# EAGLE design rlabTT (EAGLE 6.5.0)

## Sheet 1 of 2
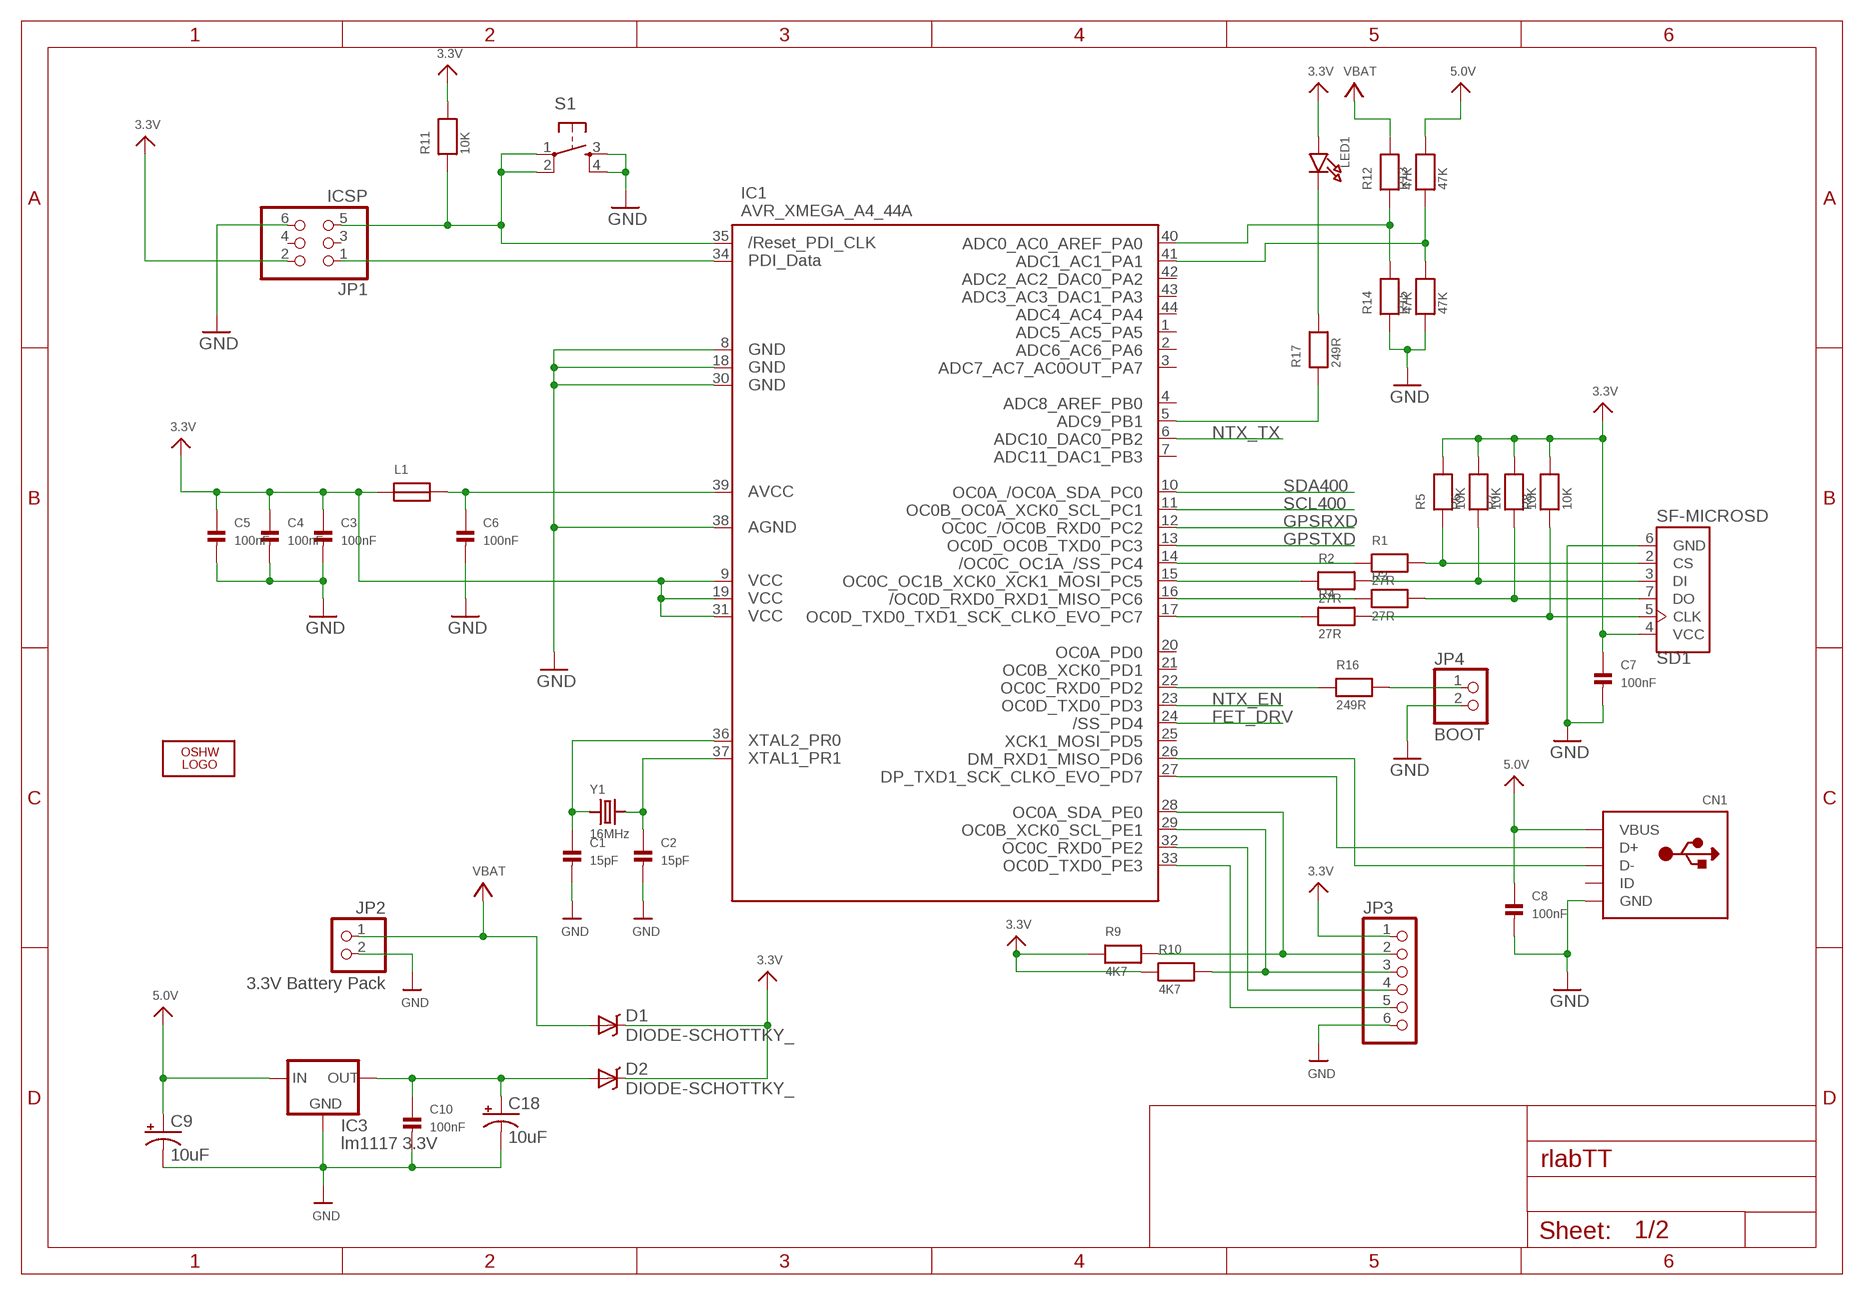
[diagram p0: schematic, sheet 1]

### Parts
C1  15pF  CAP_CERAMIC0603  [0603]
C2  15pF  CAP_CERAMIC0603  [0603]
C3  100nF  CAP_CERAMIC0603  [0603]
C4  100nF  CAP_CERAMIC0603  [0603]
C5  100nF  CAP_CERAMIC0603  [0603]
C6  100nF  CAP_CERAMIC0603  [0603]
C7  100nF  CAP_CERAMIC0603  [0603]
C8  100nF  CAP_CERAMIC0603  [0603]
C9  10uF  CAP_POL3528  [EIA3528]
C10  100nF  CAP_CERAMIC0603  [0603]
C18  10uF  CAP_POL3528  [EIA3528]
CN1  USBMINIB  [USB-MINIB]
D1  DIODE-SCHOTTKY_  [SMA-DIODE]
D2  DIODE-SCHOTTKY_  [SMA-DIODE]
IC1  AVR_XMEGA_A4_44A  [TQFP44]
IC3  lm1117 3.3V  LM1117  [SOT223]
JP1  ICSP  PINHD-2X3/90  [2X03/90]
JP2  3.3V Battery Pack  PINHD-1X2/90  [1X02/90]
JP3  PINHD-1X6/90  [1X06/90]
JP4  BOOT  PINHD-1X2/90  [1X02/90]
L1  FERRITE  [0603]
LED1  LED0603  [CHIPLED_0603]
LOGO1  OSHW_LOGO_8MILX0150-NT  [OSHW_8X150_NOTEXT]
R1  27R  RESISTOR0603  [0603]
R2  27R  RESISTOR0603  [0603]
R3  27R  RESISTOR0603  [0603]
R4  27R  RESISTOR0603  [0603]
R5  10K  RESISTOR0603  [0603]
R6  10K  RESISTOR0603  [0603]
R7  10K  RESISTOR0603  [0603]
R8  10K  RESISTOR0603  [0603]
R9  4K7  RESISTOR0603  [0603]
R10  4K7  RESISTOR0603  [0603]
R11  10K  RESISTOR0603  [0603]
R12  47K  RESISTOR0603  [0603]
R13  47K  RESISTOR0603  [0603]
R14  47K  RESISTOR0603  [0603]
R15  47K  RESISTOR0603  [0603]
R16  249R  RESISTOR0603  [0603]
R17  249R  RESISTOR0603  [0603]
S1  TAC_SWITCHSMD  [TACTILE_SWITCH_SMD]
SD1  SF-MICROSD  [MICROSD]
Y1  16MHz  CRYSTALTHIN  [CRYSTAL_3.2X2.5]

### Nets
3.3V: C3.1 C4.1 C5.1 C7.1 D1.C D2.C IC1.9(VCC1) IC1.19(VCC2) IC1.31(VCC3) JP1.2 JP3.1 L1.1 LED1.A R5.2 R6.2 R7.2 R8.2 R9.1 R10.1 R11.2 SD1.4(VCC) ; also sheet 2
5.0V: C8.1 C9.A(+) CN1.VBUS IC3.3(IN) R13.2
FET_DRV: IC1.24(PD4) ; also sheet 2
GND: C1.2 C2.2 C3.2 C4.2 C5.2 C6.2 C7.2 C8.2 C9.C(-) C10.2 C18.C(-) CN1.GND IC1.8(GND1) IC1.18(GND2) IC1.30(GND3) IC1.38(AGND) IC3.1(GND) JP1.6 JP2.2 JP3.6 JP4.2 R14.1 R15.1 S1.3 S1.4 SD1.6(GND) ; also sheet 2
GPSRXD: IC1.12(PC2) ; also sheet 2
GPSTXD: IC1.13(PC3) ; also sheet 2
N$1: IC1.40(PA0) R12.1 R14.2
N$2: IC1.22(PD2) R16.1
N$3: IC1.41(PA1) R13.1 R15.2
N$4: JP4.1 R16.2
N$5: IC1.5(PB1) R17.1
N$6: LED1.C R17.2
N$9: C2.1 IC1.37(PR1) Y1.2
N$10: C1.1 IC1.36(PR0) Y1.1
N$11: C6.1 IC1.39(AVCC) L1.2
N$13: IC1.14(PC4) R1.1
N$14: CN1.D+ IC1.27(PD7)
N$15: CN1.D- IC1.26(PD6)
N$16: IC1.15(PC5) R2.1
N$17: IC1.16(PC6) R3.1
N$18: IC1.17(PC7) R4.1
N$19: R1.2 R5.1 SD1.2(CS)
N$20: R2.2 R6.1 SD1.3(DI)
N$22: R3.2 R7.1 SD1.7(DO)
N$24: IC1.35(RESET) JP1.5 R11.1 S1.1 S1.2
N$26: IC1.34(PDI_DATA) JP1.1
N$27: C10.1 C18.A(+) D2.A IC3.2(OUT)
N$28: IC1.28(PE0) JP3.2 R9.2
N$29: IC1.29(PE1) JP3.3 R10.2
N$30: IC1.32(PE2) JP3.4
N$31: IC1.33(PE3) JP3.5
NTX_EN: IC1.23(PD3) ; also sheet 2
NTX_TX: IC1.6(PB2) ; also sheet 2
SCL400: IC1.11(PC1) ; also sheet 2
SD1: R4.2 R8.1 SD1.5(CLK)
SDA400: IC1.10(PC0) ; also sheet 2
VBAT: D1.A JP2.1 R12.2
Unconnected: CN1.ID IC1.1(PA5) IC1.2(PA6) IC1.3(PA7) IC1.4(PB0) IC1.7(PB3) IC1.20(PD0) IC1.21(PD1) IC1.25(PD5) IC1.42(PA2) IC1.43(PA3) IC1.44(PA4) JP1.3 JP1.4

## Sheet 2 of 2
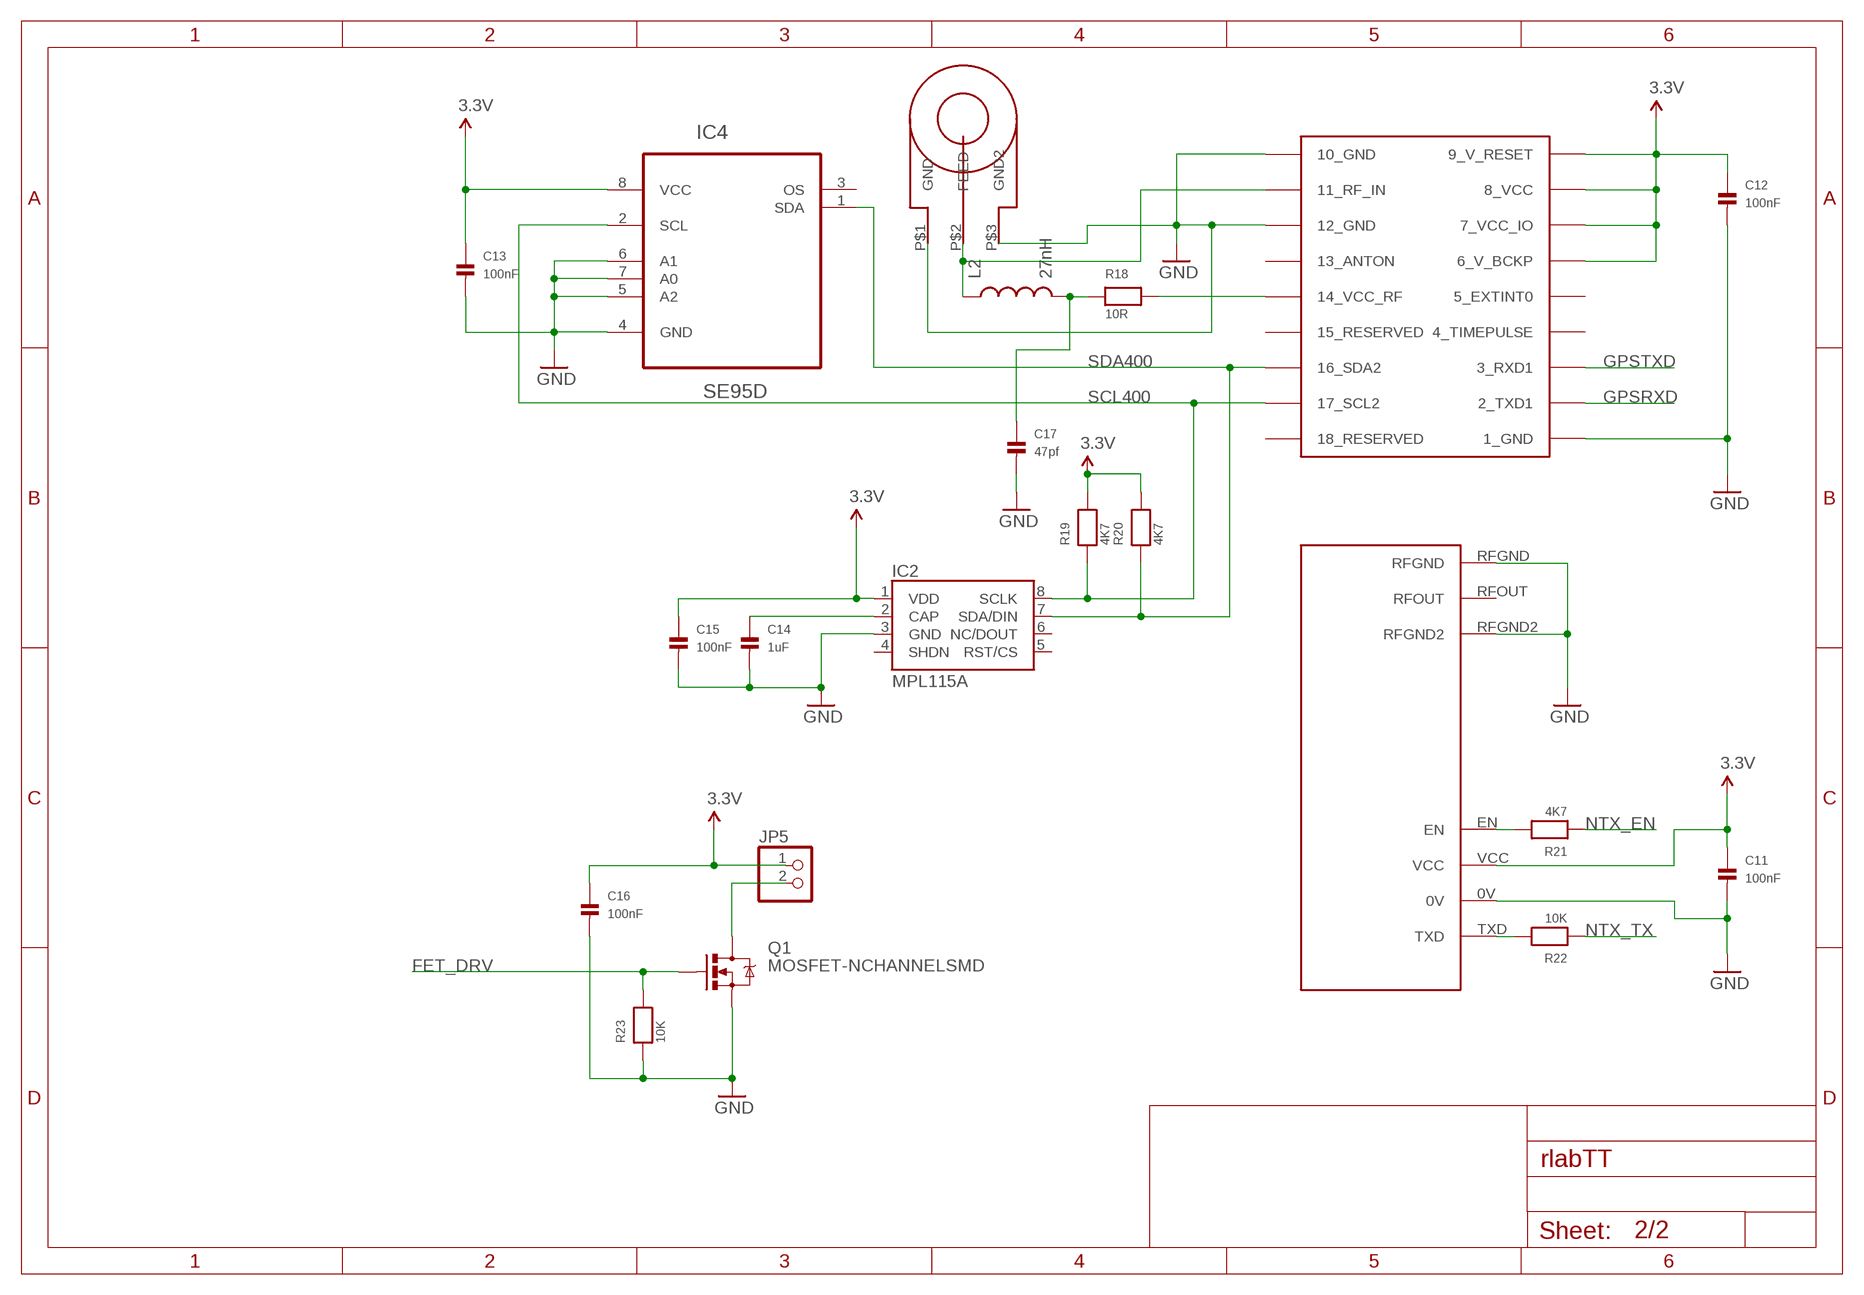
[diagram p1: schematic, sheet 2]

### Parts
C11  100nF  CAP_CERAMIC0603  [0603]
C12  100nF  CAP_CERAMIC0603  [0603]
C13  100nF  CAP_CERAMIC0603  [0603]
C14  1uF  CAP_CERAMIC0603  [0603]
C15  100nF  CAP_CERAMIC0603  [0603]
C16  100nF  CAP_CERAMIC0603  [0603]
C17  47pf  CAP_CERAMIC0603  [0603]
IC2  MPL115A  [LGA8]
IC4  SE95D  [SOIC127P600X175-8N]
JP5  PINHD-1X2/90  [1X02/90]
L2  27nH  INDUCTOR0603  [0603]
Q1  MOSFET-NCHANNELSMD  [SOT23-3]
R18  10R  RESISTOR0603  [0603]
R19  4K7  RESISTOR0603  [0603]
R20  4K7  RESISTOR0603  [0603]
R21  4K7  RESISTOR0603  [0603]
R22  10K  RESISTOR0603  [0603]
R23  10K  RESISTOR0603  [0603]
U1  UBLOX_MAX  [UBLOX_MAX]
U2  NTX2  [NTX2]
U3  SARANTEL-SL1250  [SARANTEL-SL1250]

### Nets
3.3V: C11.1 C12.1 C13.1 C15.1 C16.1 IC2.1(VDD) IC4.8(VCC) JP5.1 R19.2 R20.2 U1.6_V_BCKP U1.7_VCC_IO U1.8_VCC U1.9_V_RESET U2.VCC ; also sheet 1
FET_DRV: Q1.1(G) R23.2 ; also sheet 1
GND: C11.2 C12.2 C13.2 C14.2 C15.2 C16.2 C17.2 IC2.3(GND) IC4.4(GND) IC4.5(A2) IC4.6(A1) IC4.7(A0) Q1.2(S) R23.1 U1.1_GND U1.10_GND U1.12_GND U2.0V U2.RFGND U2.RFGND2 U3.P$1(GND) U3.P$3(GND2) ; also sheet 1
GPSRXD: U1.2_TXD1 ; also sheet 1
GPSTXD: U1.3_RXD1 ; also sheet 1
N$7: L2.1 U1.11_RF_IN U3.P$2(FEED)
N$8: R21.2 U2.EN
N$25: R18.2 U1.14_VCC_RF
N$32: C17.1 L2.2 R18.1
N$35: R22.2 U2.TXD
N$36: JP5.2 Q1.3(D)
N$37: C14.1 IC2.2(CAP)
NTX_EN: R21.1 ; also sheet 1
NTX_TX: R22.1 ; also sheet 1
SCL400: IC2.8(SCLK) IC4.2(SCL) R19.1 U1.17_SCL2 ; also sheet 1
SDA400: IC2.7(SDA/DIN) IC4.1(SDA) R20.1 U1.16_SDA2 ; also sheet 1
Unconnected: IC2.4(SHDN) IC2.5(RST/CS) IC2.6(NC/DOUT) IC4.3(OS) U1.4_TIMEPULSE U1.5_EXTINT0 U1.13_ANTON U1.15_RESERVED U1.18_RESERVED U2.RFOUT

## Library data of the parts
C1-C8 C10-C17 = microbuilder:CAP_CERAMIC: Ceramic Capacitors 0402 - 0402 Surface Mount Capacitors 0.1uF 10V 10% [Digikey: 490-1318-2-ND] 0603 - 0603 Surface Mount Capacitors 16 pF 50V 5% [Digikey: 445-5051-2-ND] 22 pF 50V [Digikey: PCC220ACVTR-ND] 33 pF 50V 5% [Digikey: 490-1415-1-ND] 56pF 50V 5% [Digikey: 490-1421-1-ND] 220pF 50V 5% [Digikey: 445-1285-1-ND] 680 pF 50V 2200 pF 50V 5% C0G [Digikey: 445-1297-1-ND] 5600 pF 100V 5% X7R [Digikey: 478-3711-1-ND] 0.1 µF 25V 10% [Digikey: PCC2277TR-ND] 0.22 µF 16V 10% X7R [Digikey: 445-1318-1-ND] 1.0 µF 25V 10% [Digikey: 445-5146-2-ND] 0603 - RF Specific 3pF 250V +/-0.1pF RF [Digikey: 712-1347-1-ND] 18 pF 250V 5% [Digikey: 478-3505-1-ND or 712-1322-1-ND] 56 pF 250V 5% C0G RF [Digikey: 490-4867-1-ND] 68 pF 250V RF [Digikey: 490-4868-1-ND] 0805 - 0805 Surface Mount Capacitors 220 pF 250V 2% RF Ceramic Capacitor [Digikey: 712-1398-1-ND] 1000 pF 50V 2% NP0 Ceramic Capacitor [Digikey: 478-3760-1-ND] 0.1 µF 25V 10% Ceramic Capacitor [Digikey: PCC1828TR-ND] 1.0 µF 16V 10% Ceramic Capacitor[Digikey: 490-1691-2-ND] 10.0 µF 10V 10% Ceramic Capacitor[Digikey: 709-1228-1-ND] 1206 - 1206 Surface Mount Capacitors
C9 C18 = SparkFun:CAP_POL: Capacitor Polarized These are standard SMD and PTH capacitors. Normally 10uF, 47uF, and 100uF in electrolytic and tantalum varieties. Always verify the external diameter of the through hole cap, it varies with capacity, voltage, and manufacturer. The EIA devices should be standard.
CN1 = adafruit:USB: USB Connectors USBMINIB - Surface Mount Female Mini-B USB Connector 4UConnector: 06564 By microbuilder.eu Thru-hole RA Female Mini-B USB Connector 4UConnector: 18732 By ladyada.net
D1 D2 = SparkFun:DIODE-SCHOTTKY
IC1 = xmega:AVR_XMEGA_A4_: Device for Atmel AVR XMEGA A4 Series
IC2 = SparkFun:MPL115A: MPL115A1 (SPI) and MPL115A2 (I2C) Miniature Digital Barometer 5.0x3.0x1.2mm LGA Package
IC3 = v-reg-3:LM1117
IC4 = NXP_By_element14_Batch_1:SE95D
JP1 = pinhead:PINHD-2X3: PIN HEADER
JP2 JP4 JP5 = pinhead:PINHD-1X2: PIN HEADER
JP3 = pinhead:PINHD-1X6: PIN HEADER
L1 = microbuilder:FERRITE: Ferrite Bead 0603 120 Ohm, 600mA Ferrite Chip - Digikey: 445-2164-1-ND
L2 = SparkFun:INDUCTOR: Inductors Basic Inductor/Choke - 0603 and 1206. Footprints are not proven and vary greatly between part numbers.
LED1 = microbuilder:LED: LED 0603 - 0603 Surface Mount Package Green LED - Low Power (3.9mcd, 2ma, 1.7Vf) Orange LED - Low Power (9.8mcd, 2ma, 1.8Vf) Red LED - Low Power (5mcd, 2ma, 1.8Vf) Yellow LED - Low Power (7mcd, 2ma, 1.8Vf) 0805 - 0805 Surface Mount Package 20mA: Red LED (104mcd, 20mA, Diffused) - LS R976 [Digikey: 475-1278-6-ND] Red LED (12mcd, 20mA, 2.0Vf, Clear) - APT2012EC [Digikey: 754-1128-1-ND] Green LED (15mcd, 20mA, 2.2Vf, Clear) - APT2012GC [Digikey: 754-1131-1-ND] Orange LED (160mcd, 20mA, 2.1Vf, Clear) - APT2012SECK [Digikey: 754-1130-1-ND] 2mA: Red LED (8.8mcd, 2mA, 1.8Vf, Clear) - Low Power [Digikey: 475-2510-1-ND] Green LED (5mcd, 2mA, 1.8Vf, Clear) - Low Power [Digikey: 475-2730-1-ND] Yellow LED (11.3mcd, 2mA, 1.8Vf, Clear) - Low Power [Digikey: 475-2555-1-ND] 1206 - 1206 Surface Mount Package Green LED (26mcd, 20mA, Diffused) - LG N971 [Digikey: 475-1407-6-ND] Red LED (15mcd, 20mA, Diffused) - LH N974 [Digikey: 475-1416-6-ND]
LOGO1 = ohw-logo:OSHW_LOGO_8MIL
Q1 = SparkFun:MOSFET-NCHANNEL
R1-R23 = microbuilder:RESISTOR: Resistors 0402 - 0402 Surface Mount Package 10.0K 1% 1/16W [Digikey: 311-10.0KLRTR-ND] 0603 - 0603 Surface Mount Package 0 Ohm 1/10 Watt 1% Resistor 15 Ohm 1/10 Watt 1% Resistor 33 Ohm 1/10 Watt 1% Resistor 49.9 Ohm 1/10 Watt 1% Resistor 100 Ohm 1/10 Watt 1% Resistor 150 Ohm 1/10 Watt 1% Resistor 240 Ohm 1/10 Watt 1% Resistor 390 Ohm 1/10 Watt 1% Resistor 560 Ohm 1/10 Watt 1% Resistor 750 Ohm 1/10 Watt 1% Resistor 1.0K Ohm 1/10 Watt 1% Resistor 1.5K Ohm 1/10 Watt 1% Resistor 2.0K Ohm 1/10 Watt 1% Resistor 4.7K Ohm 1/10 Watt 1% Resistor 10.0K Ohm 1/10 Watt 1% Resistor 20.0K Ohm 1/10 Watt 1% Resistor 33.0K Ohm 1/10 Watt 1% Resistor 100.0K Ohm 1/10 Watt 1% Resistor 0805 - 0805 Surface Mount Package 0 Ohm 1/8 Watt 1% Resistor 33 Ohm 1/8 Watt 1% Resistor 100 Ohm 1/8 Watt 1% Resistor 150 Ohm 1/8 Watt 1% Resistor 200 Ohm 1/8 Watt 1% Resistor 240 Ohm 1/8 Watt 1% Resistor 330 Ohm 1/8 Watt 1% Resistor 390 Ohm 1/8 Watt 1% Resistor 470 Ohm 1/8 Watt 1% Resistor 1.0K Ohm 1/8 Watt 1% Resistor 1.5K Ohm 1/8 Watt 1% Resistor 2.0K Ohm 1/8 Watt 1% Resistor 4.7K Ohm 1/8 Watt 1% Resistor 5.1K Ohm 1/8 Watt 1% Resistor 5.6K Ohm 1/8 Watt 1% Resistor 10.0K Ohm 1/8 Watt 1% Resistor 22.0K Ohm 1/8 Watt 1% Resistor 33.0K Ohm 1/8 Watt 1% Resistor 100K Ohm 1/8 Watt 1% Resistor 1206 - 1206 Surface Mount Package
S1 = SparkFun:TAC_SWITCH: Momentary Switch Button commonly used for reset or general input. Spark Fun Electronics SKU : COM-00097
SD1 = microsd:SF-MICROSD
U1 = Ava:UBLOX_MAX: UBLOX MAX
U2 = Ava:NTX2: Radiometrix NTX2 Transmitter Module Author Anthony Stirk / http://ava.upuaut.net
U3 = Ava:SARANTEL-SL1250: Sarantel SL1250
Y1 = microbuilder:CRYSTAL: Crystals HC49UP - Surface Mount Crystal 4.0MHz 18pF +/-30ppm Surface Mount Crystal [Digikey: 535-9857-1-ND] 12.0 MHz Surface Mount Crystal [Digikey: 535-9869-6-ND] 25.0 MHz Surface Mount Crystal [Digikey: 535-9078-1-ND] 3.2 x 2.5mm - MEMs SMT Crystal 12.0 MHz 8pF 15ppm 3.2 x 2.5mm Crystal [Digikey: 644-1047-1-ND] 16.0 MHz 8pF 15ppm 3.2 x 2.5mm Crystal [Digikey: 644-1049-1-ND] 16.0 MHz 10pF 10ppm 3.2 x 2.5mm Crystal [Digikey: 644-1100-1-ND] 27.12 MHz 18pF 30ppm 3.2 x 2.5mm Crystal [Digikey: 887-1424-1-ND] 4.9 x 1.8mm - MEMs SMT Crystal 32.768 KHz 12.5pF 20ppm 4.9 x 1.8mm Crystal [Digikey: SE2415CT-ND] Cylinder 32.768KHz Cylinder Crystal

## Board
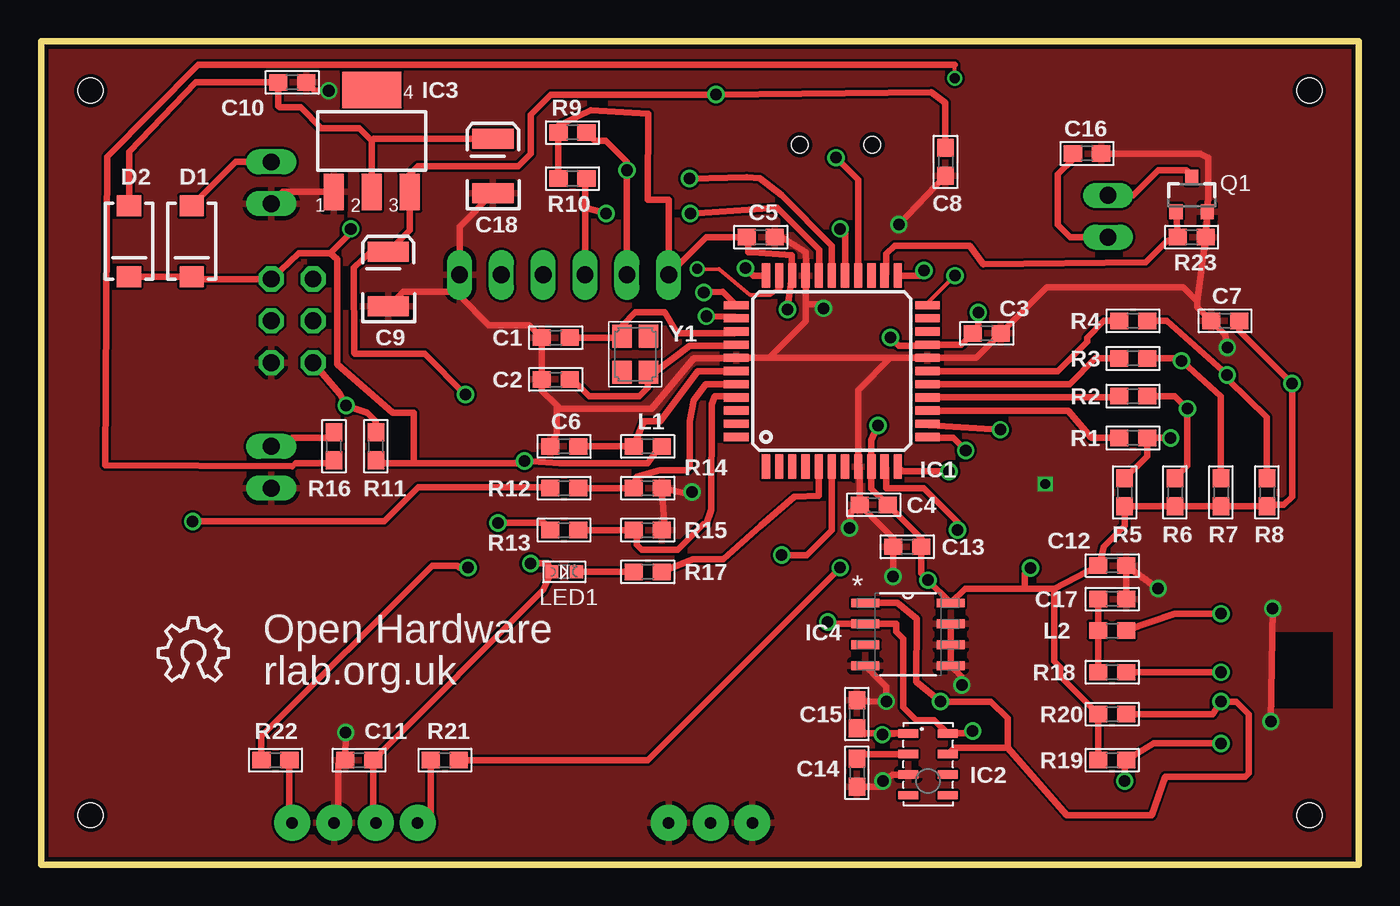
[diagram p2: board, top side]
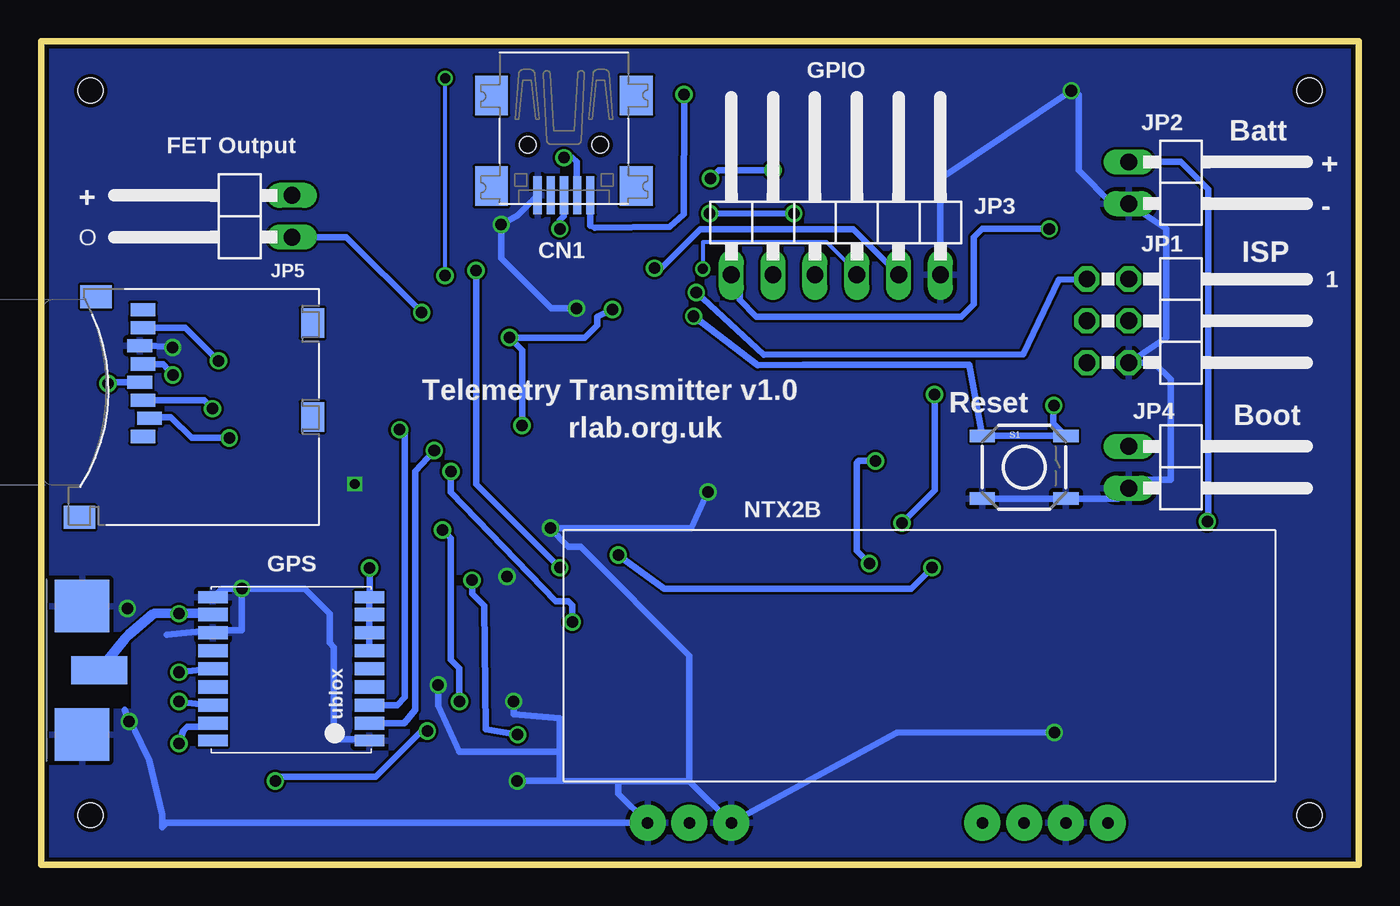
[diagram p3: board, bottom side, seen from below]

Size 80 x 50 mm. Coordinates in mm from the lower left corner, seen from the top.
Outline: 0,0 0,50 80,50 80,0 0,0
Copper layers (1*16): Top 0.035mm / dielectric 1.5mm / Bottom 0.035mm
Design rules "SeeedStudio_2layer_DRU_no_angle_20140221": minimum track width 6mil, minimum drill 12mil, track to track 6mil, track to pad 6mil, pad to pad 6mil, via to via 6mil, smd to smd 0mil, copper to edge 10mil, drill to drill 10mil, minimum pad ring 10mil, minimum via ring 6mil, stop-mask expansion 2mil, vias tented up to drill 100mil, thermal gap 10mil
Holes 1.5 mm at 3,47 77,47 77,3 3,3

### Footprints (pad centres in the part's own frame; a part is rotated, then mirrored left to right if it is on the bottom)
0603 = smd 1.1 x 1: 1 -0.85,0; 2 0.85,0
EIA3528 = smd 1.2 x 2.5: A 1.65,0; C -1.65,0
USB-MINIB = smd 0.5 x 2.308: D+ 0,4.064; D- -0.8,4.064; GND 1.6,4.064; ID 0.8,4.064; VBUS -1.6,4.064 | smd 2 x 2.4: GND1 -4.4,-2; GND2 -4.4,3.5; GND3 4.4,3.5; GND4 4.4,-2 | hole 1: -2.2,1; 2.2,1
SMA-DIODE = smd 1.27 x 1.47: A -2.15,0; C 2.15,0
TQFP44 = smd 1.5 x 0.5: 1 -5.8,4; 2 -5.8,3.2; 3 -5.8,2.4; 4 -5.8,1.6; 5 -5.8,0.8; 6 -5.8,0; 7 -5.8,-0.8; 8 -5.8,-1.6; 9 -5.8,-2.4; 10 -5.8,-3.2; 11 -5.8,-4; 23 5.8,-4; 24 5.8,-3.2; 25 5.8,-2.4; 26 5.8,-1.6; 27 5.8,-0.8; 28 5.8,0; 29 5.8,0.8; 30 5.8,1.6; 31 5.8,2.4; 32 5.8,3.2; 33 5.8,4 | smd 0.5 x 1.5: 12 -4,-5.8; 13 -3.2,-5.8; 14 -2.4,-5.8; 15 -1.6,-5.8; 16 -0.8,-5.8; 17 0,-5.8; 18 0.8,-5.8; 19 1.6,-5.8; 20 2.4,-5.8; 21 3.2,-5.8; 22 4,-5.8; 34 4,5.8; 35 3.2,5.8; 36 2.4,5.8; 37 1.6,5.8; 38 0.8,5.8; 39 0,5.8; 40 -0.8,5.8; 41 -1.6,5.8; 42 -2.4,5.8; 43 -3.2,5.8; 44 -4,5.8
LGA8 = smd 1.2 x 0.5: 1 -1.2,1.875; 2 -1.2,0.625; 3 -1.2,-0.625; 4 -1.2,-1.875; 5 1.2,-1.875; 6 1.2,-0.625; 7 1.2,0.625; 8 1.2,1.875
SOT223 = smd 1.219 x 2.235: 1 -2.311,-3.099; 2 0,-3.099; 3 2.311,-3.099 | smd 3.6 x 2.2: 4 0,3.099
SOIC127P600X175-8N = smd 1.702 x 0.533: 1 -2.591,1.905; 2 -2.591,0.635; 3 -2.591,-0.635; 4 -2.591,-1.905; 5 2.591,-1.905; 6 2.591,-0.635; 7 2.591,0.635; 8 2.591,1.905
2X03/90 = drill 1.016 octagon: 1 -2.54,-6.35; 2 -2.54,-3.81; 3 0,-6.35; 4 0,-3.81; 5 2.54,-6.35; 6 2.54,-3.81
1X02/90 = drill 1.016 long: 1 -1.27,-3.81; 2 1.27,-3.81
1X06/90 = drill 1.016 long: 1 -6.35,-3.81; 2 -3.81,-3.81; 3 -1.27,-3.81; 4 1.27,-3.81; 5 3.81,-3.81; 6 6.35,-3.81
CHIPLED_0603 = smd 0.8 x 0.8: A 0,-0.75; C 0,0.75
SOT23-3 = smd 0.8 x 0.9: 1 -0.95,-1; 2 0.95,-1; 3 0,1.1
TACTILE_SWITCH_SMD = smd 1.524 x 0.762: 1 -2.54,1.905; 2 2.54,1.905; 3 -2.54,-1.905; 4 2.54,-1.905
MICROSD = smd 0.8 x 1.5: 1 -1.94,2.7; 2 -0.84,2.3; 3 0.26,2.7; 4 1.36,2.9; 5 2.46,2.7; 6 3.56,2.9; 7 4.66,2.7; 8 5.76,2.7 | smd 1.4 x 1.9: NC -6.85,6.55; NC3 6.55,5.55 | smd 1.8 x 1.4: NC1 -0.75,-7.6; NC2 4.95,-7.6
UBLOX_MAX = smd 1.8 x 0.7: 1_GND 4.95,-4.4; 9_V_RESET 4.95,4.3; 10_GND -4.55,4.3; 18_RESERVED -4.55,-4.4 | smd 1.8 x 0.8: 2_TXD1 4.95,-3.35; 3_RXD1 4.95,-2.25; 4_TIMEPULSE 4.95,-1.15; 5_EXTINT0 4.95,-0.05; 6_V_BCKP 4.95,1.05; 7_VCC_IO 4.95,2.15; 8_VCC 4.95,3.25; 11_RF_IN -4.55,3.25; 12_GND -4.55,2.15; 13_ANTON -4.55,1.05; 14_VCC_RF -4.55,-0.05; 15_RESERVED -4.55,-1.15; 16_SDA2 -4.55,-2.25; 17_SCL2 -4.55,-3.35
NTX2 = drill 0.7 pad 2.184: 0V -2.54,-10.16; EN -7.62,-10.16; RFGND -22.86,-10.16; RFGND2 -27.94,-10.16; RFOUT -25.4,-10.16; TXD 0,-10.16; VCC -5.08,-10.16
SARANTEL-SL1250 = smd 3.2 x 3.3: P$1 -3.9,-2.15; P$3 3.9,-2.15 | smd 1.7 x 3.4: P$2 0,-3.2
CRYSTAL_3.2X2.5 = smd 1.4 x 1.2: 1 -1.1,-0.8; 2 1.1,0.8; GND1 -1.1,0.8; GND2 1.1,-0.8

### Placement (x,y rotation side)
C1  31.24,32 180 top
C2  31.24,29.46 180 top
C3  57.4,32.26 0 top
C4  50.55,21.84 180 top
C5  43.69,38.1 0 top
C6  31.75,25.4 180 top
C7  71.88,33.02 180 top
C8  54.9,42.67 270 top
C9  21.08,35.56 90 top
C10  15.24,47.5 0 top
C11  19.3,6.35 180 top
C12  65.02,18.16 0 top
C13  52.58,19.3 180 top
C14  49.53,5.59 270 top
C15  49.53,9.14 90 top
C16  63.5,43.18 0 top
C17  65.02,16.13 0 top
C18  27.43,42.42 90 top
CN1  48.26,44.7 180 bottom
D1  9.14,37.85 270 top
D2  5.33,37.85 270 top
IC1  48.01,29.97 90 top
IC2  53.85,6.1 0 top
IC3  20.07,43.94 0 top
IC4  52.63,13.99 0 top
JP1  10.16,33.02 270 bottom
JP2  10.16,41.4 270 bottom
JP3  31.75,39.62 0 bottom
JP4  10.16,24.13 270 bottom
JP5  68.58,39.37 90 bottom
L1  36.83,25.4 180 top
L2  65.02,14.22 180 top
LED1  31.75,17.78 270 top
LOGO1  7.11,11.18 0 top
Q1  69.85,40.64 0 top
R1  66.29,25.91 0 top
R2  66.29,28.45 0 top
R3  66.29,30.73 0 top
R4  66.29,33.02 0 top
R5  65.79,22.61 270 top
R6  68.83,22.61 270 top
R7  71.63,22.61 270 top
R8  74.42,22.61 270 top
R9  32.26,44.45 0 top
R10  32.26,41.66 0 top
R11  20.32,25.4 270 top
R12  31.75,22.86 180 top
R13  31.75,20.32 180 top
R14  36.83,22.86 180 top
R15  36.83,20.32 180 top
R16  17.78,25.4 90 top
R17  36.83,17.78 180 top
R18  65.02,11.68 0 top
R19  65.02,6.35 180 top
R20  65.02,9.14 180 top
R21  24.51,6.35 180 top
R22  14.22,6.35 0 top
R23  69.85,38.1 180 top
S1  20.32,24.13 0 bottom
SD1  71.12,27.94 90 bottom
U1  65.02,11.94 0 bottom
U2  15.24,12.7 0 bottom
U3  79.67,11.8 90 bottom
Y1  36.07,30.99 270 top

### Tracks (layer width: path | path; a pad name or v marks a point on that pad's centre or on a via)
3.3V  (via drill 0.7)
  Top 0.406: C7.1 72.73,32.42 v75.95,29.21 75.95,22.35 75.44,21.84 74.51,21.84 R8.2 R7.2 R6.2 R5.2 65.79,20.57 64.52,19.3 64.26,18.25 C12.1 61.51,16.76 | C16.1 62.65,42.84 61.72,41.91 61.72,38.86 62.48,38.1 JP5.1 | C15.1 49.85,7.97 IC2.1 52.64,8 v51.07,7.89 | U2.VCC 20.15,2.71 C11.1 30.49,16.69 LED1.A 30.75,18.29 v29.72,18.29 | v56.9,33.53 56.9,32.6 C3.1 55.87,31.57 IC1.19 53.73,31.5 52.07,31.5 v51.56,32 | R10.1 R9.1 31.41,44.87 33.36,45.81 36.85,45.6 36.83,40.64 36.83,40.39 38.1,40.39 JP3.1 40.39,38.1 C5.1 42.93,37.85 42.93,37.19 43.19,37.19 45.57,36.99 45.57,35.92 IC1.31 45.57,35.64 v45.31,33.71 | R11.2 20.49,24.38 22.61,24.38 | 22.61,24.38 29.21,24.38 v29.34,24.51 31.5,24.38 36.83,24.38 37.45,25.29 L1.1 | R19.2 R20.2 61.88,11.44 61.88,11.99 61.51,12.36 61.51,16.76 | v50.8,26.67 50.41,25.77 IC1.9 50.41,22.83 C4.1 53.43,19.81 C13.1 53.43,17.68 v53.84,17.27 IC4.8 56.09,16.76 59.71,16.76 | D2.C D1.C 9.28,35.56 JP1.2 15.63,37.12 17.56,37.12 | 17.56,37.12 17.98,36.76 17.96,30.39 21.34,27.43 22.61,27.43 22.61,24.38 | 17.56,37.12 18.8,38.35 v18.8,38.61 | 59.71,16.76 61.51,16.76 | v60.06,18.02 59.71,17.67 59.71,16.76
  Bottom 0.406: SD1.4 75.86,29.3 v75.95,29.21 | v56.9,33.53 61.47,38.1 JP5.1 | v50.8,26.67 50.8,31.24 v51.56,32 46.99,32 46.23,32.77 46.23,33.27 v45.31,33.71 | v29.72,18.29 30.48,19.05 30.48,24.38 30.35,24.51 v29.34,24.51 | JP3.1 37.59,35.31 37.59,34.29 36.58,33.27 24.13,33.27 23.37,34.04 23.37,38.1 22.86,38.61 v18.8,38.61 | v60.06,18.02 U1.9_V_RESET U1.8_VCC U1.7_VCC_IO U1.6_V_BCKP | v51.07,7.89 52.99,8.22 53.11,15.73 53.84,16.45 v53.84,17.27
5.0V  (via drill 0.7)
  Top 0.406: C8.1 54.88,46.26 54.05,46.91 v40.96,46.76 30.93,46.76 29.72,45.54 29.72,43.18 28.96,42.42 22.86,42.42 22.38,41.94 IC3.3 22.38,38.51 C9.A 20,37.21 18.97,36.24 19.01,31.08 19.05,31.02 23.28,31.02 v25.76,28.54 | R13.2 30.53,20.75 v27.73,20.75
  Bottom 0.406: v40.96,46.76 40.95,46.62 40.99,39.48 41.82,38.74 46.38,38.69 46.66,38.78 CN1.VBUS | v27.73,20.75 25.76,22.72 v25.76,28.54
FET_DRV
  Top 0.406: IC1.24 51.31,35.87 51.31,37.08 51.82,37.59 56.39,37.59 57.19,36.45 67.06,36.58 68.33,37.85 R23.2 Q1.1
GND  (via drill 0.6, 0.7)
  Top 0.406: v72.02,31.4 71.88,32.17 C7.2 70.19,33.86 70.19,34.2 | 70.19,34.2 R23.1 Q1.2 70.87,40.47 70.87,42.93 70.36,43.18 C16.2 | 51.56,30.77 IC1.18 56.77,30.77 C3.2 61.05,35.05 69.34,35.05 70.19,34.2 | 51.56,30.77 44.2,30.77 | 44.2,30.77 IC1.38 42.17,30.73 39.62,30.73 37.08,27.69 31.5,27.69 31.3,27.88 | 46.41,34.04 IC1.30 46.48,35.85 46.43,37.18 44.96,38.1 C5.2 | 46.41,34.04 46.41,32.98 44.2,30.77 | 51.56,30.77 49.61,28.82 IC1.8 49.7,24.08 C4.2 | 51.82,19.22 C13.2 | C13.2 51.73,19.81 C4.2 | IC2.3 51.7,5.47 v51.1,5.09 50.97,4.74 C14.2 | C15.2 49.62,9.91 v51.31,9.92 51.31,10.81 IC4.4 | v67.82,16.76 C12.2 C17.2 | U2.0V 18.03,2.79 18.03,6.1 18.29,6.35 C11.2 v18.49,8.03 | 31.3,27.88 30.39,28.79 C2.2 C1.2 29.63,32.77 27.18,32.77 25.4,34.54 JP3.6 | v52.07,38.86 C8.2 | v47.5,33.78 47.24,34.04 46.41,34.04 | C9.C 21.97,34.8 25.15,34.8 25.4,35.05 JP3.6 | JP2.2 14.68,40.84 IC3.1 | C10.2 16.6,46.99 v17.46,46.99 | C4.2 49.14,21.42 v49.09,20.44 | v74.77,15.56 v74.66,8.69 | IC4.7 IC4.6 IC4.5 55.87,11.43 v55.9,10.92 | v51.71,17.49 51.73,17.51 C13.2 | C6.2 31.3,26.17 31.3,27.88 | R15.1 37.85,20.39 R14.1 38.98,22.59 v39.52,22.63 | C18.C 25.4,38.74 JP3.6
  Bottom 0.406: SD1.6 71.91,31.46 v72.02,31.4 | v51.31,9.92 51.31,9.14 48.51,8.89 48.51,5.08 | U1.10_GND 69.05,16.76 v67.82,16.76 | v67.82,16.76 67.82,14.22 69.44,14.22 U1.12_GND 69.71,14.22 72.39,13.97 | 40.64,5.08 44.96,5.08 | 44.96,5.08 48.51,5.08 | 48.51,5.08 v51.1,5.09 | 44.96,5.08 44.96,4.32 U2.RFGND2 72.39,2.54 72.64,2.29 72.64,3.05 73.43,6.33 74.93,9.4 v74.66,8.69 | v47.5,33.78 49.02,33.78 52.07,36.83 v52.07,38.86 51.05,39.45 CN1.GND | S1.3 S1.4 14.61,22.23 JP4.2 13.46,23.37 11.43,23.37 11.43,29.46 12.45,30.48 JP1.6 11.68,32 11.68,38.61 JP2.2 14.99,40.13 17.02,42.16 17.02,46.74 v17.46,46.99 25.4,41.66 JP3.6 | U1.1_GND 60.16,7.62 62.23,7.62 62.23,13.21 62.48,13.46 62.48,15.24 64.01,16.76 v67.82,16.76 | 40.64,5.08 40.64,12.7 47.24,19.3 48.01,19.3 v49.09,20.44 40.53,20.44 v39.52,22.63 | 40.64,5.08 U2.RFGND 28.07,8 v18.49,8.03 | 48.51,5.08 48.51,6.86 54.61,6.86 55.88,9.65 v55.9,10.92
  other vias: 60.96,23.11
  pour Top: 0,0 0,50 80,50 80,0
  pour Bottom: 0,0 0,50 80,50 80,0
GPSRXD  (via drill 0.7)
  Top 0.406: IC1.12 53.87,25.91 55.37,25.91 v56.13,25.15
  Bottom 0.406: v56.13,25.15 57.28,23.88 57.28,9.4 57.96,8.59 U1.2_TXD1
GPSTXD  (via drill 0.7)
  Top 0.406: IC1.13 53.91,26.67 v58.23,26.41
  Bottom 0.406: v58.23,26.41 57.91,26.42 57.91,10.16 58.38,9.69 U1.3_RXD1
N$1
  Top 0.406: IC1.40 40.35,29.17 39.62,28.19 39.37,26.92 39.37,24.12 39.19,23.95 37.54,23.95 36.15,23.57 R14.2 R12.1
N$2  (via drill 0.61, 0.7)
  Top 0.254: 15.24,24.18 15.44,24.38 | v55.47,47.75 55.47,48.56 | v55.47,35.76 53.85,34.14 IC1.22 | 17.68,24.38 R16.1
  Top 0.406: 15.44,24.38 17.68,24.38 | 15.24,24.18 3.88,24.27 4.02,42.99 9.55,48.56 55.47,48.56
  Bottom 0.254: v55.47,35.76 v55.47,47.75
N$3
  Top 0.406: IC1.41 42.13,28.45 40.89,28.45 40.71,27.96 40.69,21.56 40.38,20.66 40.21,20.66 38.66,19.11 36.47,19.11 36.15,19.44 36.15,20.37 R15.2 R13.1
N$4
  Top 0.406: R16.2 17.44,25.91 15.24,25.91 14.73,25.4 JP4.1
N$5
  Top 0.406: R17.1 39.59,18.56 41.4,18.54 43.69,20.57 45.72,22.35 47.21,22.39 IC1.5
N$6
  Top 0.406: LED1.C R17.2
N$7  (via drill 0.7)
  Top 0.406: L2.1 68.83,15.24 v71.63,15.24
  Bottom 0.406: v71.63,15.24 73.18,15.22 | U1.11_RF_IN 69.66,15.27
  Bottom 0.61: U3.P$2 74.93,13.72 74.68,13.97 73.18,15.22 69.66,15.27
N$8
  Top 0.406: U2.EN 23.66,2.54 R21.2
N$9
  Top 0.406: IC1.37 42.13,31.5 39.37,31.5 37.25,29.89 Y1.2 36.83,29.85 36.83,28.96 36.32,28.45 33.27,28.45 32.26,29.46 C2.1
N$10
  Top 0.406: IC1.36 42.09,32.26 38.61,32.26 37.85,33.53 36.07,33.53 35.27,32.73 Y1.1 35.18,32 C1.1
N$11
  Top 0.406: C6.1 L1.2 36.58,26.92 37.59,26.92 39.88,29.97 IC1.39
N$13
  Top 0.406: IC1.14 62.34,27.57 63.75,25.91 R1.1
N$14  (via drill 0.7)
  Top 0.406: IC1.27 48.81,38.32 v48.51,38.61
  Bottom 0.406: v48.51,38.61 48.51,39.12 48.26,39.37 CN1.D+
N$15  (via drill 0.7)
  Top 0.406: IC1.26 49.61,41.58 v48.26,42.93
  Bottom 0.406: v48.26,42.93 47.75,42.93 47.5,42.67 47.5,40.68 CN1.D-
N$16
  Top 0.406: IC1.15 65.37,28.37 R2.1
N$17
  Top 0.406: IC1.16 62.45,29.17 64.01,30.73 R3.1
N$18
  Top 0.406: IC1.17 61.72,29.97 63.5,31.75 63.5,32 64.52,33.02 R4.1
N$19  (via drill 0.7)
  Top 0.406: R5.1 67.14,24.81 R1.2 v68.58,25.91
  Bottom 0.406: v68.58,25.91 70.87,25.91 72.14,27.18 73.34,27.18 SD1.2
N$20  (via drill 0.7)
  Top 0.406: R2.2 68.83,28.45 v69.6,27.69 69.6,24.22 R6.1
  Bottom 0.406: SD1.3 70.11,28.2 v69.6,27.69
N$22  (via drill 0.7)
  Top 0.406: R3.2 69.09,30.73 v69.24,30.59 | v69.24,30.59 69.36,30.49 | 69.36,30.49 71.63,28.45 R7.1 | v69.24,30.59 69.25,30.59 69.36,30.49
  Bottom 0.406: SD1.7 71.25,32.6 v69.24,30.59
N$24  (via drill 0.7)
  Top 0.406: R11.1 20.32,26.92 19.81,27.43 v18.52,27.87 18.14,28.6 JP1.5 | IC1.35 42.1,33.27 v40.38,33.3
  Bottom 0.406: v18.52,27.87 18.54,26.8 S1.2 S1.1 23.65,30.36 33.72,30.35 36.49,30.31 v40.38,33.3
N$25  (via drill 0.7)
  Top 0.406: v71.63,11.68 R18.2
  Bottom 0.406: U1.14_VCC_RF 69.52,11.94 v71.63,11.68
N$26  (via drill 0.7)
  Top 0.406: IC1.34 41.38,34.8 v40.23,34.75
  Bottom 0.406: v40.23,34.75 36.12,30.96 20.37,30.98 18.22,35.52 JP1.1
N$27
  Top 0.406: D2.A 5.33,43.3 9.4,47.5 C10.1 14.39,46.06 14.48,45.97 15.75,45.97 17.02,44.7 19.3,44.7 20.07,43.94 | IC3.2 20.07,43.94 | 27.18,44.32 C18.A 20.19,44.07 20.07,43.94
N$28  (via drill 0.7)
  Top 0.406: R9.2 33.62,43.94 34.29,43.94 35.56,42.67 v35.56,42.16 JP3.2 | IC1.28 48.01,37.59 44.96,40.64 43.61,41.68 42.84,41.73 v39.37,41.66
  Bottom 0.406: v39.37,41.66 38.86,42.16 v35.56,42.16
N$29  (via drill 0.7)
  Top 0.406: R10.2 33.02,41.57 33.02,39.88 | 33.02,39.88 JP3.3 | IC1.29 47.24,35.81 47.24,37.34 44.7,39.88 v39.41,39.53 | v34.3,39.55 33.02,39.88
  Bottom 0.406: v39.41,39.53 v34.3,39.55
N$30  (via drill 0.61)
  Top 0.254: v39.83,36.17 41.17,36.16 43.01,34.61 44.3,34.61 44.7,34.95 44.8,34.95
  Top 0.406: IC1.32 44.83,35.69 44.8,34.95 44.8,34.94
  Bottom 0.254: v39.83,36.17 39.83,37.8 32.31,37.8 30.48,35.97 JP3.4
N$31  (via drill 0.7)
  Top 0.406: v42.77,36.22 43.22,35.77 IC1.33
  Bottom 0.406: JP3.5 30.71,38.58 31.33,38.58 31.34,38.57 39.99,38.57 42.34,36.22 v42.77,36.22
N$32
  Top 0.406: R18.1 L2.2 C17.1
N$35
  Top 0.406: U2.TXD 15.07,2.54 R22.2
N$36
  Top 0.406: JP5.2 66.29,40.64 67.82,42.16 69.51,42.16 Q1.3
N$37
  Top 0.406: IC2.2 49.81,6.72 C14.1
NTX_EN  (via drill 0.7)
  Top 0.406: 48.51,17.78 v48.51,18.03 36.83,6.35 R21.1 | v53.59,36.07 53.3,35.77 IC1.23
  Bottom 0.406: v48.51,18.03 53.59,23.11 v53.59,36.07
NTX_TX  (via drill 0.7)
  Top 0.406: v25.91,18.03 25.4,18.03 25.27,18.16 23.75,18.16 13.37,7.79 R22.1 | IC1.6 48.01,20.32 46.48,18.8 v44.96,18.8
  Bottom 0.406: v25.91,18.03 27.18,16.76 42.16,16.76 v44.96,18.8
SCL400  (via drill 0.7)
  Top 0.406: v71.63,7.37 67.56,7.37 R19.1 65.79,6.26 v65.79,5.08 | v56.56,8.12 56.23,7.97 IC2.8 54.24,8.78 53.13,8.78 52.35,9.56 52.35,13.71 51.92,14.14 51.92,14.61 51.91,14.62 IC4.2 47.86,14.62 v47.75,14.73 | IC1.11 52.3,23.88 v55.12,23.88
  Bottom 0.406: U1.17_SCL2 69.78,8.38 71.12,8.38 71.37,8.13 v71.63,7.37 | v65.79,5.08 65.53,5.33 59.69,5.33 56.9,8.13 v56.56,8.12 | v55.12,23.88 55.12,22.61 48.77,16 48.01,16 47.75,15.75 v47.75,14.73
SD1  (via drill 0.7)
  Top 0.406: R4.2 68.33,33.02 v72.01,29.74 | v72.01,29.74 72.09,29.41 | 72.09,29.41 74.42,27.18 R8.1 | v72.01,29.74 71.84,29.66 72.09,29.41
  Bottom 0.406: SD1.5 72.58,30.4 v72.01,29.74
SDA400  (via drill 0.7)
  Top 0.406: R20.1 71.12,9.14 v71.63,9.91 72.55,9.91 73.32,9.14 73.32,5.55 73.12,5.35 68.24,5.35 67.43,3.01 62.27,3.01 58.67,7.11 | IC2.7 55.44,7.11 58.67,7.11 | 58.67,7.11 58.67,8.89 57.66,9.91 v54.61,9.91 53.13,11.09 53.17,14.92 51.97,15.89 IC4.1 | IC1.10 51.31,24.07 51.31,22.86 53.59,22.86 55.63,20.83 v55.63,20.32
  Bottom 0.406: U1.16_SDA2 69.61,9.65 v71.63,9.91 | v55.63,20.32 55.12,19.81 55.12,12.45 54.61,11.94 v54.61,9.91
VBAT  (via drill 0.7)
  Top 0.406: D1.A 11.82,42.67 JP2.1 | R12.2 30.93,22.91 22.89,22.91 20.82,20.84 v9.2,20.84
  Bottom 0.406: v9.2,20.84 9.15,20.89 9.15,41.01 10.81,42.67 JP2.1

### Text on the board
tNames: Open Hardware | rlab.org.uk
bNames: GPIO | Batt | FET Output | + | + | - | O | ISP | 1 | Telemetry Transmitter v1.0 | Boot | Reset | rlab.org.uk | NTX2B | GPS